# EAGLE board CLU (EAGLE 9.6.1)
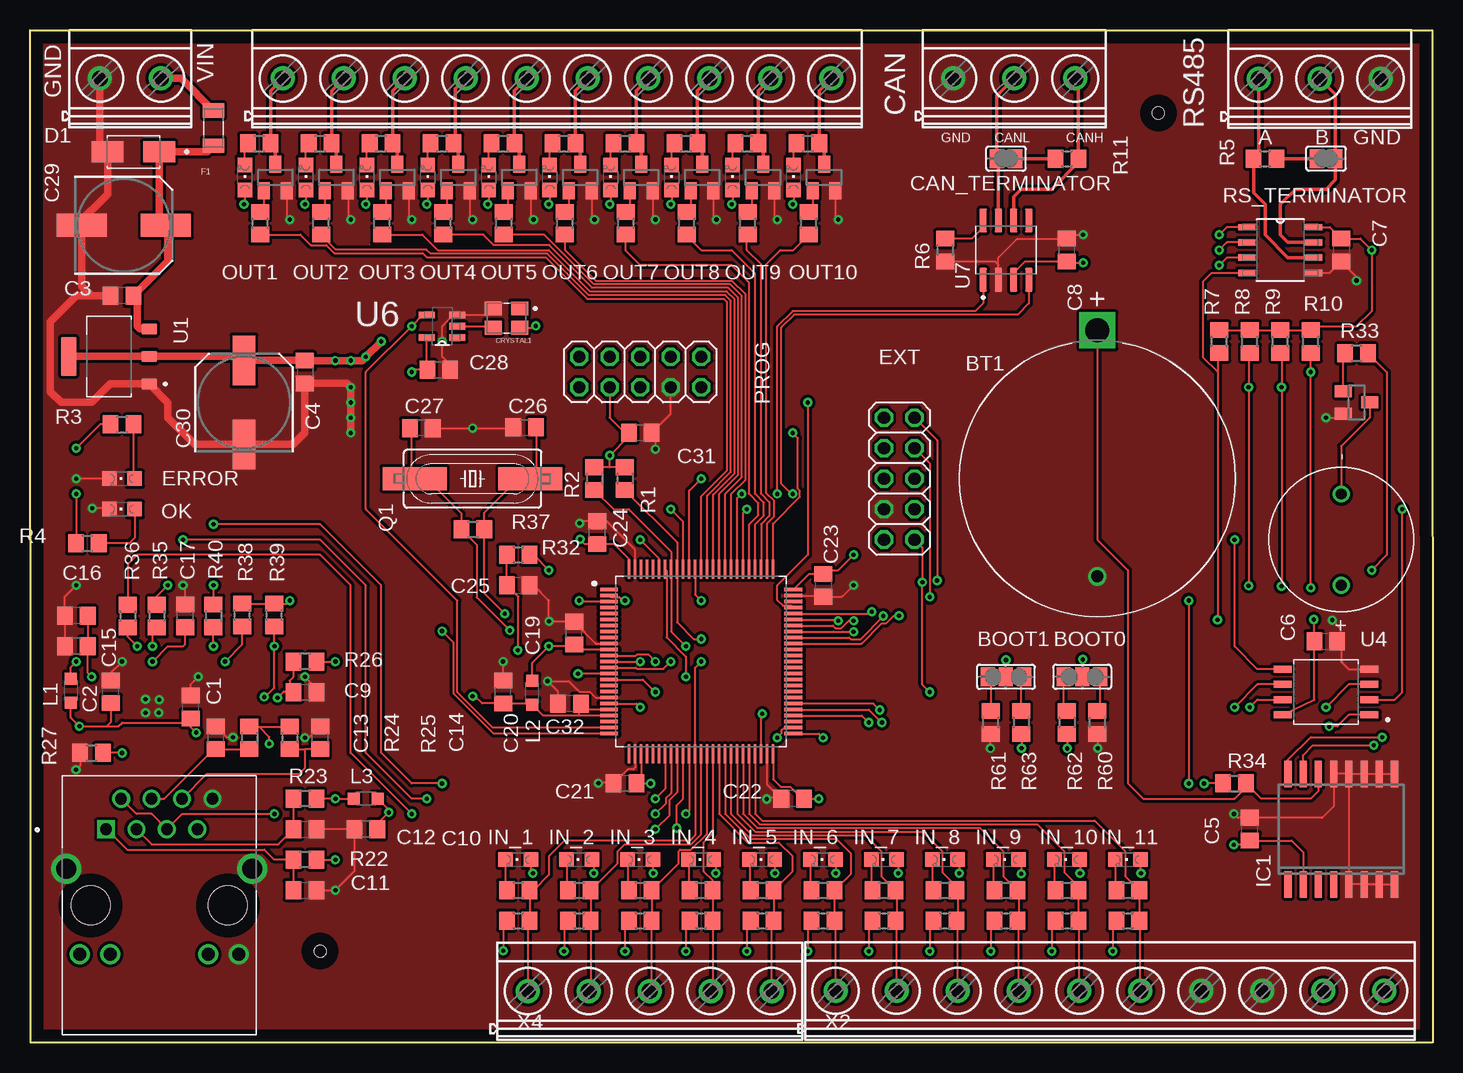
[diagram p2: board, top side]
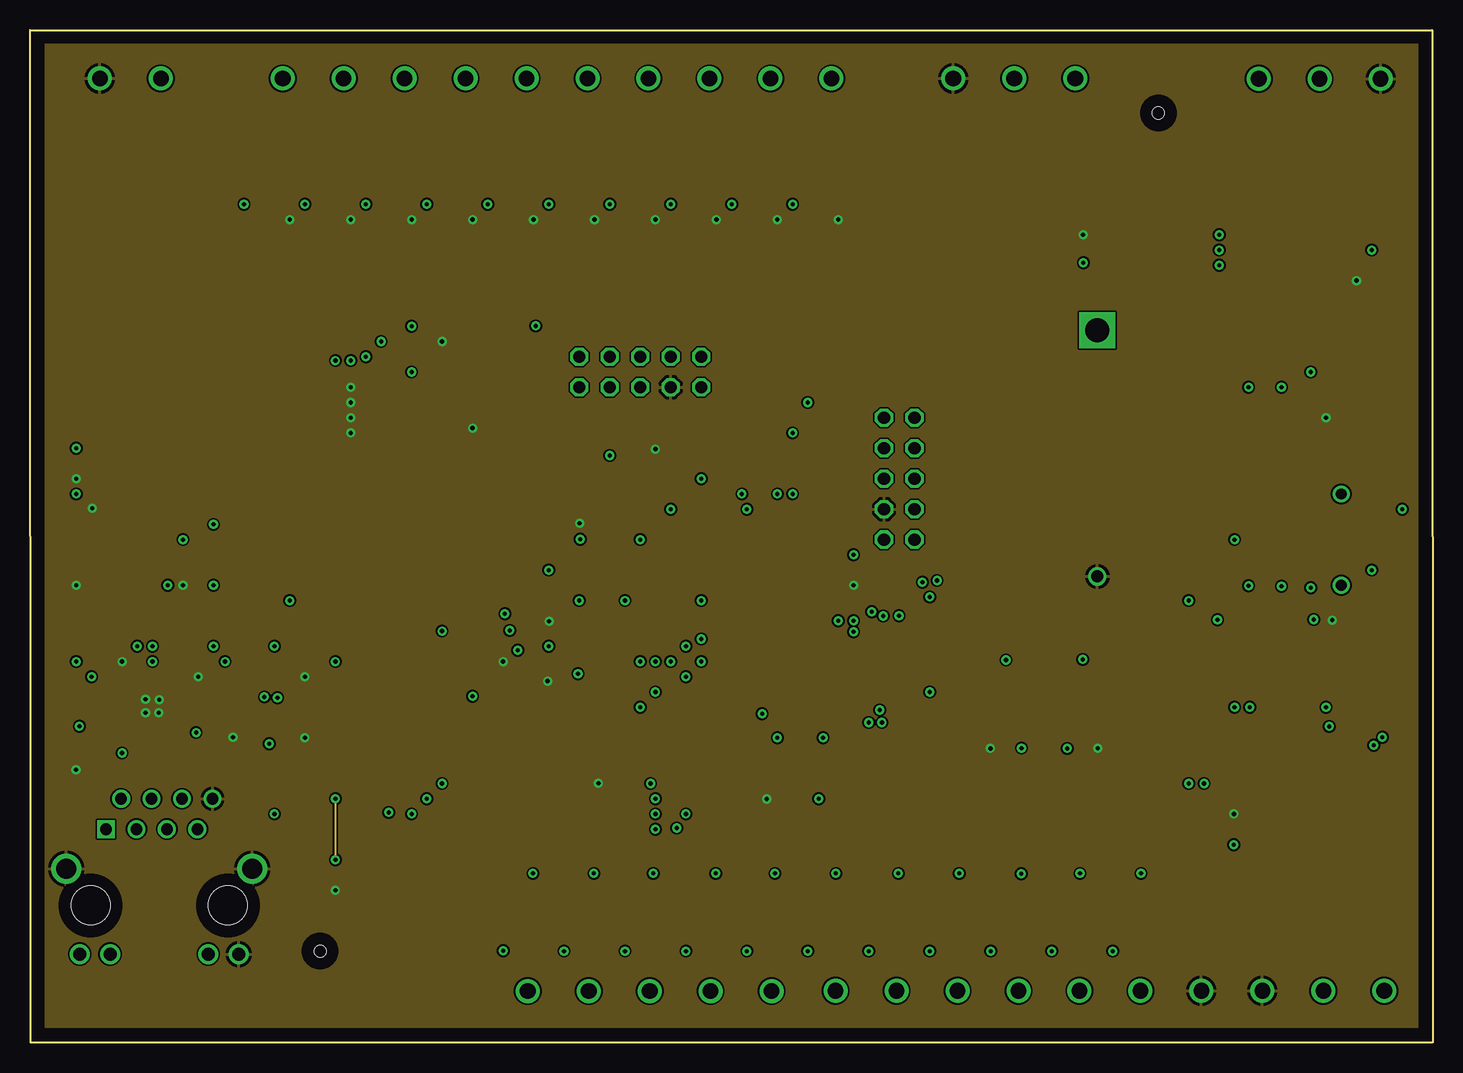
[diagram p3: board, inner layer GND]
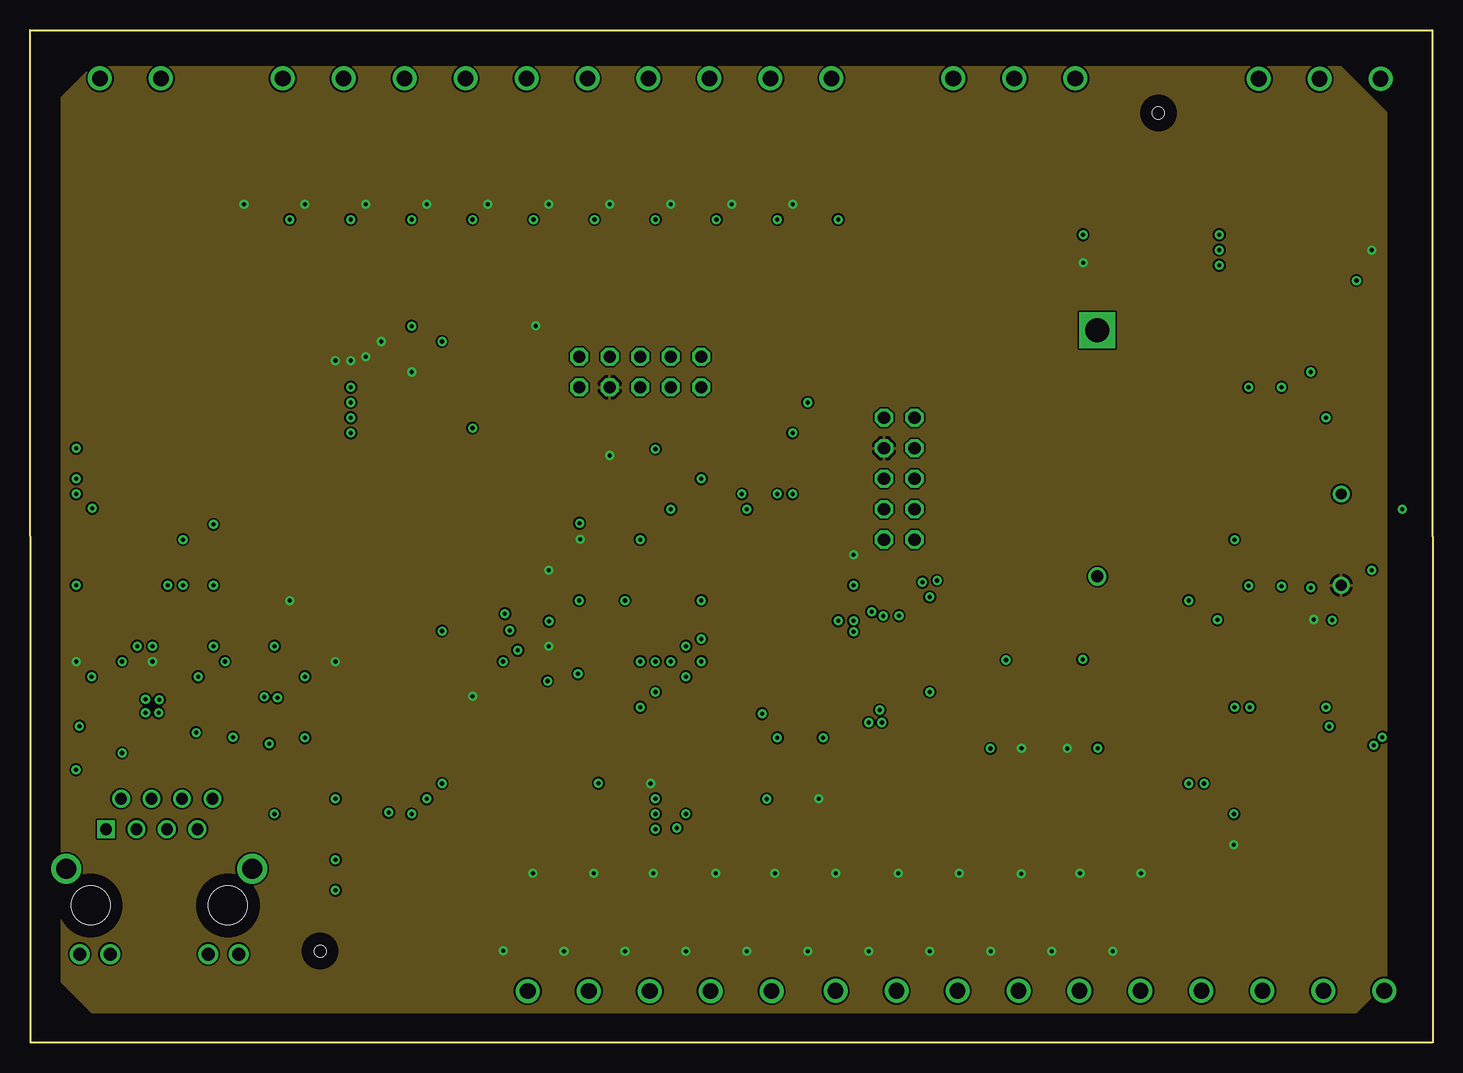
[diagram p4: board, inner layer VCC]
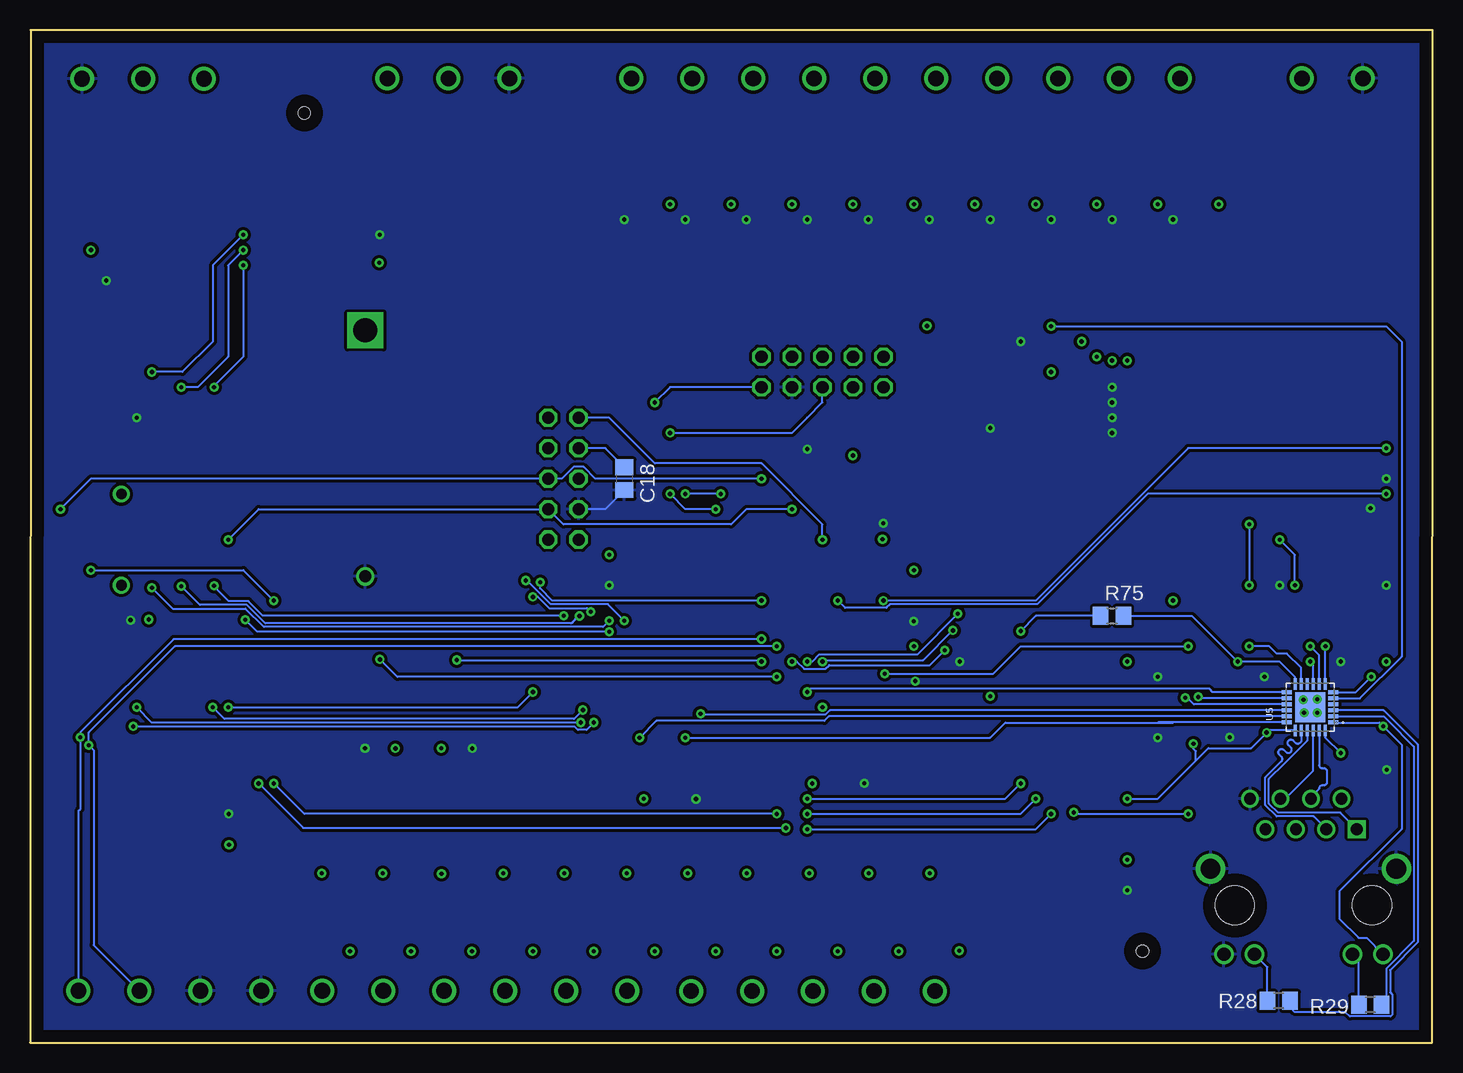
[diagram p5: board, bottom side, seen from below]

Size 116.89 x 84.38 mm. Coordinates in mm from the lower left corner, seen from the top.
Outline: 0.05,0 0,84.38 116.84,84.38 116.89,0 0.05,0
Copper layers (1+2*15+16): Top 0.035mm / dielectric 1.5mm / GND 0.035mm / dielectric 0.15mm / VCC 0.035mm / dielectric 0.2mm / Bottom 0.035mm
Design rules "default *": minimum track width 6mil, minimum drill 0.35mm, track to track 6mil, track to pad 6mil, pad to pad 6mil, via to via 6mil, smd to smd 6mil, copper to edge 40mil, drill to drill 6mil, minimum pad ring 10mil, minimum via ring 8mil, stop-mask expansion 4mil, vias tented up to drill 0mil, thermal gap 10mil
Net classes: 0 default: width 0.152 mm, drill 0.35 mm, clearance 0.152 mm; 1 SIGNALS: width 0.508 mm, drill 0.35 mm, clearance 0.152 mm; 2 GND: width 0.889 mm, clearance 0.152 mm; 3 DIFFERENTIAL: clearance 0.762 mm
Holes 1 mm at 94.03,77.47 24.18,7.62

## Footprints (pad centres in the part's own frame; a part is rotated, then mirrored left to right if it is on the bottom)
SJ_2 = smd 1.168 x 1.6: 1 -1.524,0; 2 0,0; 3 1.524,0
BAT_VL-2320/HFN = drill 1: N -8.15,0 | drill 2 square: P 12.35,0
C0805 = smd 1.3 x 1.5: 1 -0.95,0; 2 0.95,0
SANYO-OSCON_SMD_E7 = smd 4.15 x 1.9: + 3.5,0; - -3.5,0
SJ = smd 1.168 x 1.6: 1 -0.762,0; 2 0.762,0
LFSPXO025560-SMD-4 = smd 1.4 x 1.15: 1 -1.1,-0.8; 2 1.1,-0.8; 3 1.1,0.8; 4 -1.1,0.8
DIO_ES1J = smd 2.65 x 1.75: A 2.15,0; K -2.15,0
CHIPLED_0805 = smd 1.2 x 1.2: A 0,-1.05; C 0,1.05
2X05 = drill 1.016 octagon: 1 -5.08,-1.27; 2 -5.08,1.27; 3 -2.54,-1.27; 4 -2.54,1.27; 5 0,-1.27; 6 0,1.27; 7 2.54,-1.27; 8 2.54,1.27; 9 5.08,-1.27; 10 5.08,1.27
FUSC1206X75N = smd 1.19 x 1.77: 1 -1.465,0; 2 1.465,0
SO16W = smd 0.6 x 2.2: 1 -4.445,-4.6; 2 -3.175,-4.6; 3 -1.905,-4.6; 4 -0.635,-4.6; 5 0.635,-4.6; 6 1.905,-4.6; 7 3.175,-4.6; 8 4.445,-4.6; 9 4.445,4.6; 10 3.175,4.6; 11 1.905,4.6; 12 0.635,4.6; 13 -0.635,4.6; 14 -1.905,4.6; 15 -3.175,4.6; 16 -4.445,4.6
BEL_SI-60062-F = drill 0.97 square: 1 -4.445,6.35 | drill 0.97: 2 -3.175,8.89; 3 -1.905,6.35; 4 -0.635,8.89; 5 0.635,6.35; 6 1.905,8.89; 7 3.175,6.35; 8 4.445,8.89 | drill 1.1: 9 -6.625,-4.06; 10 -4.085,-4.06; 11 4.085,-4.06; 12 6.625,-4.06 | drill 1.65: S1 -7.745,3.05; S2 7.745,3.05 | hole 3.25: 5.715,0; -5.715,0
L2012C = smd 1 x 1: 1 -1,0; 2 1,0
CUI_CEM-1205C = drill 0.9: N 3.8,0; P -3.8,0
HC49UP = smd 5.334 x 1.93: 1 -4.826,0; 2 4.826,0
R0805 = smd 1.3 x 1.5: 1 -0.95,0; 2 0.95,0
SOT23 = smd 1 x 1.4: 1 -0.95,-1.1; 2 0.95,-1.1; 3 0,1.1
SOT229P700X180-4N = smd 1.31 x 0.93: 1 -3.345,2.29; 2 -3.345,0; 3 -3.345,-2.29 | smd 1.31 x 3.24: 4 3.345,0
SOIC127P600X175-8N = smd 1.422 x 0.533: 1 -2.794,1.905; 2 -2.794,0.635; 3 -2.794,-0.635; 4 -2.794,-1.905; 5 2.794,-1.905; 6 2.794,-0.635; 7 2.794,0.635; 8 2.794,1.905
QFP50P1600X1600X160-100N = smd 1.56 x 0.28: 1 -7.68,6; 2 -7.68,5.5; 3 -7.68,5; 4 -7.68,4.5; 5 -7.68,4; 6 -7.68,3.5; 7 -7.68,3; 8 -7.68,2.5; 9 -7.68,2; 10 -7.68,1.5; 11 -7.68,1; 12 -7.68,0.5; 13 -7.68,0; 14 -7.68,-0.5; 15 -7.68,-1; 16 -7.68,-1.5; 17 -7.68,-2; 18 -7.68,-2.5; 19 -7.68,-3; 20 -7.68,-3.5; 21 -7.68,-4; 22 -7.68,-4.5; 23 -7.68,-5; 24 -7.68,-5.5; 25 -7.68,-6; 51 7.68,-6; 52 7.68,-5.5; 53 7.68,-5; 54 7.68,-4.5; 55 7.68,-4; 56 7.68,-3.5; 57 7.68,-3; 58 7.68,-2.5; 59 7.68,-2; 60 7.68,-1.5; 61 7.68,-1; 62 7.68,-0.5; 63 7.68,0; 64 7.68,0.5; 65 7.68,1; 66 7.68,1.5; 67 7.68,2; 68 7.68,2.5; 69 7.68,3; 70 7.68,3.5; 71 7.68,4; 72 7.68,4.5; 73 7.68,5; 74 7.68,5.5; 75 7.68,6 | smd 0.28 x 1.56: 26 -6,-7.68; 27 -5.5,-7.68; 28 -5,-7.68; 29 -4.5,-7.68; 30 -4,-7.68; 31 -3.5,-7.68; 32 -3,-7.68; 33 -2.5,-7.68; 34 -2,-7.68; 35 -1.5,-7.68; 36 -1,-7.68; 37 -0.5,-7.68; 38 0,-7.68; 39 0.5,-7.68; 40 1,-7.68; 41 1.5,-7.68; 42 2,-7.68; 43 2.5,-7.68; 44 3,-7.68; 45 3.5,-7.68; 46 4,-7.68; 47 4.5,-7.68; 48 5,-7.68; 49 5.5,-7.68; 50 6,-7.68; 76 6,7.68; 77 5.5,7.68; 78 5,7.68; 79 4.5,7.68; 80 4,7.68; 81 3.5,7.68; 82 3,7.68; 83 2.5,7.68; 84 2,7.68; 85 1.5,7.68; 86 1,7.68; 87 0.5,7.68; 88 0,7.68; 89 -0.5,7.68; 90 -1,7.68; 91 -1.5,7.68; 92 -2,7.68; 93 -2.5,7.68; 94 -3,7.68; 95 -3.5,7.68; 96 -4,7.68; 97 -4.5,7.68; 98 -5,7.68; 99 -5.5,7.68; 100 -6,7.68
SOIC127P790X216-8N = smd 1.61 x 0.58: 1 -3.605,1.905; 2 -3.605,0.635; 3 -3.605,-0.635; 4 -3.605,-1.905; 5 3.605,-1.905; 6 3.605,-0.635; 7 3.605,0.635; 8 3.605,1.905
QFN50P400X400X100-25N = smd 0.86 x 0.26: 1 -1.935,1.25; 2 -1.935,0.75; 3 -1.935,0.25; 4 -1.935,-0.25; 5 -1.935,-0.75; 6 -1.935,-1.25; 13 1.935,-1.25; 14 1.935,-0.75; 15 1.935,-0.25; 16 1.935,0.25; 17 1.935,0.75; 18 1.935,1.25 | smd 0.26 x 0.86: 7 -1.25,-1.935; 8 -0.75,-1.935; 9 -0.25,-1.935; 10 0.25,-1.935; 11 0.75,-1.935; 12 1.25,-1.935; 19 1.25,1.935; 20 0.75,1.935; 21 0.25,1.935; 22 -0.25,1.935; 23 -0.75,1.935; 24 -1.25,1.935 | smd 2.5 x 2.5: 25 0,0
SOT95P280X145-5N = smd 1.321 x 0.559: 1 -1.27,0.94; 2 -1.27,0; 3 -1.27,-0.94; 4 1.27,-0.94; 5 1.27,0.94
SOIC127P599X175-8N = smd 1.97 x 0.6: 1 -2.47,1.905; 2 -2.47,0.635; 3 -2.47,-0.635; 4 -2.47,-1.905; 5 2.47,-1.905; 6 2.47,-0.635; 7 2.47,0.635; 8 2.47,1.905
MKDSN1,5/10-5,08 = drill 1.3 pad 2: 1 -22.881,0.025; 2 -17.801,0.025; 3 -12.721,0.025; 4 -7.641,0.025; 5 -2.561,0.025; 6 2.519,0.025; 7 7.599,0.025; 8 12.679,0.025; 9 17.759,0.025; 10 22.839,0.025
MKDSN1,5/2-5,08 = drill 1.3 pad 2: 1 -2.561,0.025; 2 2.519,0.025
MKDSN1,5/5-5,08 = drill 1.3 pad 2: 1 -10.181,0.025; 2 -5.101,0.025; 3 -0.021,0.025; 4 5.059,0.025; 5 10.139,0.025
MKDSN1,5/3-5,08 = drill 1.3 pad 2: 1 -7.641,0.025; 2 -2.561,0.025; 3 2.519,0.025

## Placement (x,y rotation side)
BOOT0  [SJ_2]  87.68,30.48 180 top
BOOT1  [SJ_2]  81.33,30.48 0 top
BT1  VL-2320/HFN  [BAT_VL-2320/HFN]  88.95,46.99 90 top
C1  100nF  [C0805]  13.39,27.97 90 top
C2  100nF  [C0805]  6.73,29.24 90 top
C3  100nF  [C0805]  7.67,62.23 180 top
C4  100nF  [C0805]  22.91,55.88 270 top
C5  100nF  [C0805]  101.65,17.78 90 top
C6  100nF  [C0805]  107.98,33.45 0 top
C7  100nF  [C0805]  109.27,66.04 270 top
C8  100nF  [C0805]  86.41,66.04 90 top
C9  100nF  [C0805]  22.91,29.21 0 top
C10  0.022uF  [C0805]  27.99,17.78 180 top
C11  100nF  [C0805]  22.91,12.7 0 top
C12  100nF  [C0805]  22.91,17.78 0 top
C13  100nF  [C0805]  15.49,25.4 90 top
C14  100nF  [C0805]  24.18,25.4 90 top
C15  470pF  [C0805]  3.86,33.02 180 top
C16  1uF  [C0805]  3.86,35.56 180 top
C17  100nF  [C0805]  12.93,35.56 90 top
C18  100nF  [C0805]  67.36,46.99 270 bottom
C19  100nF  [C0805]  45.34,34.11 90 top
C20  100nF  [C0805]  39.42,29.21 90 top
C21  100nF  [C0805]  49.58,21.59 180 top
C22  100nF  [C0805]  63.55,20.32 180 top
C23  100nF  [C0805]  66.09,38.1 270 top
C24  100nF  [C0805]  47.27,42.49 90 top
C25  100nF  [C0805]  40.69,38.1 0 top
C26  22pF  [C0805]  41.22,51.26 0 top
C27  22pF  [C0805]  32.61,51.21 180 top
C28  100nF  [C0805]  34.06,56.06 0 top
C29  100uF  [SANYO-OSCON_SMD_E7]  7.82,68.1 0 top
C30  100uF  [SANYO-OSCON_SMD_E7]  17.83,53.34 90 top
C31  100nF  [C0805]  50.85,50.8 180 top
C32  100nF  [C0805]  44.96,28.24 180 top
CAN_TERMINATOR  [SJ]  81.33,73.66 0 top
CRYSTAL1  LFSPXO025560  [LFSPXO025560-SMD-4]  39.7,60.38 180 top
D1  BYG10D  [DIO_ES1J]  8.61,74.22 180 top
ERROR  [CHIPLED_0805]  7.67,46.99 90 top
EXT  [2X05]  72.44,46.99 270 top
F1  ERBRG1R25V  [FUSC1206X75N]  15.29,76.2 270 top
IC1  DS3231/SO  [SO16W]  109.27,17.78 0 top
IN_1  [CHIPLED_0805]  40.69,15.24 90 top
IN_2  [CHIPLED_0805]  45.77,15.24 90 top
IN_3  [CHIPLED_0805]  50.85,15.24 90 top
IN_4  [CHIPLED_0805]  55.93,15.24 90 top
IN_5  [CHIPLED_0805]  61.01,15.24 90 top
IN_6  [CHIPLED_0805]  66.09,15.24 90 top
IN_7  [CHIPLED_0805]  71.17,15.24 90 top
IN_8  [CHIPLED_0805]  76.25,15.24 90 top
IN_9  [CHIPLED_0805]  81.33,15.24 90 top
IN_10  [CHIPLED_0805]  86.41,15.24 90 top
IN_11  [CHIPLED_0805]  91.49,15.24 90 top
J2  SI-60062-F  [BEL_SI-60062-F]  10.77,11.43 0 top
L1  [L2012C]  3.4,29.34 270 top
L2  [L2012C]  41.86,29.16 90 top
L3  [L2012C]  27.99,20.32 180 top
LS1  CEM-1205C  [CUI_CEM-1205C]  109.27,41.91 90 top
OK  [CHIPLED_0805]  7.67,44.45 90 top
OUT1  [CHIPLED_0805]  17.91,72.09 0 top
OUT2  [CHIPLED_0805]  22.99,72.09 0 top
OUT3  [CHIPLED_0805]  28.07,72.09 0 top
OUT4  [CHIPLED_0805]  33.15,72.09 0 top
OUT5  [CHIPLED_0805]  38.23,72.09 0 top
OUT6  [CHIPLED_0805]  43.31,72.09 0 top
OUT7  [CHIPLED_0805]  48.39,72.09 0 top
OUT8  [CHIPLED_0805]  53.47,72.09 0 top
OUT9  [CHIPLED_0805]  58.55,72.09 0 top
OUT10  [CHIPLED_0805]  63.63,72.09 0 top
PROG  [2X05]  50.85,55.88 180 top
Q1  [HC49UP]  36.88,46.99 0 top
R1  10k  [R0805]  49.58,46.99 270 top
R2  10k  [R0805]  47.04,46.99 270 top
R3  330R  [R0805]  7.67,51.51 0 top
R4  330R  [R0805]  4.78,41.61 0 top
R5  120R  [R0805]  102.92,73.66 0 top
R6  4k7  [R0805]  76.25,66.04 270 top
R7  10k  [R0805]  99.11,58.42 90 top
R8  10k  [R0805]  101.65,58.42 90 top
R9  10k  [R0805]  104.19,58.42 90 top
R10  10k  [R0805]  106.73,58.42 90 top
R11  120R  [R0805]  86.41,73.66 0 top
R12  10k  [R0805]  19.18,68.28 90 top
R13  10k  [R0805]  24.26,68.28 90 top
R14  10k  [R0805]  29.34,68.28 90 top
R15  10k  [R0805]  34.42,68.28 90 top
R16  10k  [R0805]  39.5,68.28 90 top
R17  10k  [R0805]  44.58,68.28 90 top
R18  10k  [R0805]  49.66,68.28 90 top
R19  10k  [R0805]  54.74,68.28 90 top
R20  10k  [R0805]  59.82,68.28 90 top
R21  10k  [R0805]  64.9,68.28 90 top
R22  49R9  [R0805]  22.91,15.24 180 top
R23  49R9  [R0805]  22.91,20.32 180 top
R24  49R9  [R0805]  18.29,25.4 270 top
R25  49R9  [R0805]  21.64,25.4 270 top
R26  4k7  [R0805]  22.91,31.75 180 top
R27  12.1k  [R0805]  5.13,24.13 0 top
R28  200R  [R0805]  12.83,3.48 180 bottom
R29  200R  [R0805]  5.21,3.15 180 bottom
R30  10k  [R0805]  45.77,10.16 0 top
R31  10k  [R0805]  50.85,10.16 0 top
R32  10k  [R0805]  40.69,40.64 0 top
R33  10k  [R0805]  110.54,57.43 180 top
R34  200R  [R0805]  100.38,21.59 0 top
R35  100R  [R0805]  10.57,35.53 270 top
R36  100R  [R0805]  8.15,35.53 270 top
R37  1M  [R0805]  36.91,42.77 0 top
R38  1k5  [R0805]  17.68,35.64 90 top
R39  1k5  [R0805]  20.35,35.64 90 top
R40  100R  [R0805]  15.29,35.56 270 top
R41  10k  [R0805]  61.01,10.16 0 top
R42  10k  [R0805]  71.17,10.16 0 top
R43  10k  [R0805]  55.93,10.16 0 top
R44  10k  [R0805]  40.69,10.16 0 top
R45  10k  [R0805]  66.09,10.16 0 top
R46  10k  [R0805]  76.25,10.16 0 top
R47  10k  [R0805]  86.41,10.16 0 top
R48  10k  [R0805]  81.33,10.16 0 top
R49  10k  [R0805]  91.49,10.16 0 top
R50  200R  [R0805]  19.1,74.93 0 top
R51  200R  [R0805]  24.18,74.93 0 top
R52  200R  [R0805]  29.26,74.93 0 top
R53  200R  [R0805]  34.34,74.93 0 top
R54  200R  [R0805]  39.42,74.93 0 top
R55  200R  [R0805]  44.5,74.93 0 top
R56  200R  [R0805]  49.58,74.93 0 top
R57  200R  [R0805]  54.66,74.93 0 top
R58  200R  [R0805]  59.74,74.93 0 top
R59  200R  [R0805]  64.82,74.93 0 top
R60  10k  [R0805]  88.95,26.67 90 top
R61  10k  [R0805]  80.06,26.67 90 top
R62  10k  [R0805]  86.41,26.67 270 top
R63  10k  [R0805]  82.6,26.67 270 top
R64  200R  [R0805]  40.69,12.7 0 top
R65  200R  [R0805]  45.77,12.7 0 top
R66  200R  [R0805]  50.85,12.7 0 top
R67  200R  [R0805]  55.93,12.7 0 top
R68  200R  [R0805]  61.01,12.7 0 top
R69  200R  [R0805]  66.09,12.7 0 top
R70  200R  [R0805]  71.17,12.7 0 top
R71  200R  [R0805]  76.25,12.7 0 top
R72  200R  [R0805]  81.33,12.7 0 top
R73  200R  [R0805]  86.41,12.7 0 top
R74  200R  [R0805]  91.49,12.7 0 top
R75  100R  [R0805]  26.72,35.56 0 bottom
RS_TERMINATOR  [SJ]  108,73.66 0 top
T1  BC848  [SOT23]  20.45,72.09 0 top
T2  BC848  [SOT23]  25.53,72.09 0 top
T3  BC848  [SOT23]  30.61,72.09 0 top
T4  BC848  [SOT23]  35.69,72.09 0 top
T5  BC848  [SOT23]  40.77,72.09 0 top
T6  BC848  [SOT23]  45.85,72.09 0 top
T7  BC848  [SOT23]  50.93,72.09 0 top
T8  BC848  [SOT23]  56.01,72.09 0 top
T9  BC848  [SOT23]  61.09,72.09 0 top
T10  BC848  [SOT23]  66.17,72.09 0 top
T11  BC848  [SOT23]  110.54,53.34 270 top
U1  AMS1117  [SOT229P700X180-4N]  6.58,57.18 180 top
U2  ST3485ECDR  [SOIC127P600X175-8N]  104.19,66.04 0 top
U3  STM32F107VCT6  [QFP50P1600X1600X160-100N]  55.93,31.75 0 top
U4  W25Q64BVSSIG  [SOIC127P790X216-8N]  108,29.21 180 top
U5  LAN8720A-CP  [QFN50P400X400X100-25N]  10.21,27.94 180 bottom
U6  74LVC1G17W5-7  [SOT95P280X145-5N]  34.34,59.69 180 top
U7  SN65HVD230  [SOIC127P599X175-8N]  81.33,66.04 90 top
X1  MKDSN1,5/10-5,08  [MKDSN1,5/10-5,08]  43.94,80.31 0 top
X2  MKDSN1,5/10-5,08  [MKDSN1,5/10-5,08]  90.02,4.29 0 top
X3  MKDSN1,5/2-5,08  [MKDSN1,5/2-5,08]  8.38,80.31 0 top
X4  MKDSN1,5/5-5,08  [MKDSN1,5/5-5,08]  51.66,4.27 0 top
X5  MKDSN1,5/3-5,08  [MKDSN1,5/3-5,08]  84.58,80.31 0 top
X6  MKDSN1,5/3-5,08  [MKDSN1,5/3-5,08]  110.03,80.29 0 top

## Tracks (layer width: path | path; a pad name or v marks a point on that pad's centre or on a via)
12V
  Top 0.152: C29.+ 10.83,68.1 10.76,68.03
  Top 0.61: F1.2 14.77,74.22 D1.K 10.76,68.03 11.48,67.31 11.48,65.09 C3.1 8.94,61.91 8.94,59.69 9.17,59.47 U1.3
BOOT0  (via drill 0.35)
  Top 0.152: 87.36,30.8 BOOT0.2 87.73,30.53 v87.73,31.93 | U3.94 53.06,39.3 53.06,33.76 54.66,32.16 v54.66,30.48
  Bottom 0.152: v54.66,30.48 86.28,30.48 v87.73,31.93
BUZZER  (via drill 0.35)
  Top 0.152: U3.36 54.93,19.32 v54.66,19.05 | R33.1 113.04,55.88 113.08,55.88 113.08,40.64 v111.81,39.37 | v96.57,36.83 v96.57,21.59
  Bottom 0.152: v54.66,19.05 94.03,19.05 v96.57,21.59 | v111.81,39.37 99.11,39.37 v96.57,36.83
CAN_RX  (via drill 0.35)
  Top 0.152: 59.47,44.18 v59.74,44.45 59.43,44.14 U3.81 | v63.55,45.72 63.45,45.72 62.61,46.56 62.61,59.59 63.68,60.66 82.3,60.66 83.24,61.59 U7.4
  Bottom 0.152: v59.74,44.45 62.28,44.45 v63.55,45.72
CAN_TX  (via drill 0.35)
  Top 0.152: U3.82 58.93,45.37 59.28,45.72 v59.32,45.72 | v62.28,45.72 62.28,59.69 63.55,60.96 78.79,60.96 79.43,61.59 U7.1
  Bottom 0.152: v59.32,45.72 v62.28,45.72
EHT_MDIO_LAN  (via drill 0.35)
  Top 0.152: 17.83,34.53 R38.1 17.68,33.17 v16.26,31.75
  Bottom 0.152: U5.12 11.46,30.46 12.75,31.75 v16.26,31.75 20.07,35.56 R75.2
ETH_CRS_DV  (via drill 0.35)
  Top 0.152: U3.32 52.93,21.13 v52.12,20.32 | v34.34,21.59 31.8,21.59 29.26,24.13 29.26,38.1 24.18,43.18 v15.29,43.18 | v15.29,38.1 R40.1
  Bottom 0.152: v52.12,20.32 35.61,20.32 v34.34,21.59 | v15.29,43.18 v15.29,38.1
ETH_INT  (via drill 0.35)
  Top 0.152: v19.53,28.8 19.61,28.8 20.37,29.57 v20.37,33.02 20.37,34.66 R39.1 | U3.15 45.68,30.75 v45.67,30.73
  Bottom 0.152: U5.14 19.53,28.69 v19.53,28.8 | v20.37,33.02 34.34,33.02 36.63,30.73 v45.67,30.73
ETH_LED1
  Bottom 0.152: R28.1 11.88,2.94 11.48,2.54 7.27,2.54 6.9,2.17 3.51,2.17 3.38,2.31 3.38,3.99 3.56,4.17 3.56,6.04 1.25,8.34 1.25,24.86 3.95,27.55 4.09,27.69 U5.3
ETH_LED2
  Bottom 0.152: R29.1 4.26,2.94 3.86,2.54 3.86,6.16 1.56,8.47 1.56,24.66 3.71,26.82 3.95,27.05 4.09,27.19 U5.2
ETH_MDC  (via drill 0.35)
  Top 0.152: U3.16 51.08,30.25 v52.12,29.21
  Bottom 0.152: U5.13 12.17,29.21 18.34,29.21 18.59,29.46 51.87,29.46 v52.12,29.21
ETH_MDIO  (via drill 0.35)
  Top 0.152: U3.25 38.64,25.75 35.31,29.08 35.31,33.33 v34.34,34.29
  Bottom 0.152: R75.1 33.07,35.56 v34.34,34.29
ETH_RBIAS  (via drill 0.35)
  Top 0.152: v7.67,24.13 R27.2
  Bottom 0.152: U5.24 8.96,25.42 v7.67,24.13
ETH_RST  (via drill 0.35)
  Top 0.152: R26.2 21.96,30.48 21.64,30.16 21.64,29.23 21.13,29.23 21.11,29.21 | 21.64,29.21 C9.1 21.11,29.21 | v20.62,28.73 20.74,28.84 21.11,29.21
  Bottom 0.152: U5.15 19.91,28.19 20.45,28.73 v20.62,28.73
ETH_RX_N
  Top 0.152: R25.2 22.91,24.45 | C14.1 22.91,24.45 | J2.6 14.74,22.39 22.44,22.39 22.91,22.86 22.91,24.45
  Bottom 0.152: U5.22 9.96,22.63 12.27,20.32 J2.6
ETH_RX_P
  Top 0.152: J2.4 11.19,20.32 15.32,24.45 C13.1 R24.2
  Bottom 0.152: U5.23 9.46,23.13 arc-90 9.19,22.86 9.08,22.86 arc90 8.81,22.6 8.81,21.7 arc90 9.08,21.43 9.19,21.43 arc-90 9.46,21.16 10.3,20.32 J2.4
ETH_RXD0  (via drill 0.35)
  Top 0.152: U3.33 53.43,20.79 52.99,20.35 52.99,19.92 v52.12,19.05 | v33.07,20.32 31.8,20.32 27.99,24.13 27.99,38.1 24.18,41.91 v12.75,41.91 | R35.1 10.57,37.19 v11.48,38.1
  Bottom 0.152: v52.12,19.05 34.34,19.05 v33.07,20.32 | v11.48,38.1 11.48,40.64 v12.75,41.91
ETH_RXD1  (via drill 0.35)
  Top 0.152: U3.34 53.93,20.86 53.29,20.22 53.29,18.95 v52.12,17.78 | v31.8,19.05 26.72,24.13 26.72,38.1 24.18,40.64 8.94,40.64 8.15,39.85 R36.1
  Bottom 0.152: v31.8,19.05 33.07,17.78 v52.12,17.78
ETH_TX_EN  (via drill 0.35)
  Top 0.152: U3.48 60.93,27.33 v61.01,27.41
  Bottom 0.152: U5.16 50.24,27.69 50.6,27.33 60.94,27.33 v61.01,27.41
ETH_TX_N
  Top 0.152: R23.2 C12.1 20.69,16.51 10.13,16.51 J2.3
  Bottom 0.152: U5.20 10.96,25.08 11.06,24.98 arc90 11.44,24.98 11.62,25.16 arc-90 12,25.16 12.01,25.15 arc-90 12.01,24.77 11.83,24.59 arc90 11.83,24.22 11.84,24.2 arc90 12.22,24.2 12.4,24.39 arc-90 12.77,24.39 12.79,24.37 arc-90 12.79,24 12.6,23.82 arc90 12.6,23.44 13.95,22.1 13.95,19.79 13,18.85 9.93,18.85 J2.3
ETH_TX_P
  Top 0.152: C11.1 R22.2 20.37,15.24 19.53,16.08 8.1,16.08 6.4,17.78 J2.1
  Bottom 0.152: U5.21 10.46,25.15 10.85,24.77 12.39,23.22 13.64,21.97 13.64,19.92 12.87,19.15 7.7,19.15 J2.1
ETH_TXD0  (via drill 0.35)
  Top 0.152: U3.51 65.74,25.75 v66.09,25.4
  Bottom 0.152: U5.17 50.31,27.19 50.7,26.8 64.69,26.8 v66.09,25.4
ETH_TXD1  (via drill 0.35)
  Top 0.152: v62.28,25.4 62.6,25.72 62.6,25.96 62.89,26.25 U3.52
  Bottom 0.152: v62.28,25.4 36.88,25.4 35.61,26.67 22.91,26.67 | 22.91,26.67 21.64,26.67 | U5.18 22.89,26.69 22.91,26.67
ETH_VDDA  (via drill 0.35)
  Top 0.152: 6.83,28.18 C2.1 6.73,26.69 6.4,26.36 | 6.4,26.36 v4.12,26.36 3.4,27.08 L1.2 | R24.1 18.34,26.3 19.1,26.3 | 6.4,26.36 7.36,26.36 7.67,26.67 13.04,26.67 C1.1 13.39,26.29 v13.84,25.83 | 21.62,26.38 R25.1 21.59,26.3 19.1,26.3 | L3.2 v25.45,20.32 R23.1 | R22.1 v25.45,15.24 | v19.94,24.89 19.94,25.46 19.1,26.3
  GND 0.152: v25.45,20.32 v25.45,15.24
  Bottom 0.152: U5.1 8.26,26.67 4.42,26.67 v4.11,26.36 v4.12,26.36 2.59,24.84 2.59,17.78 7.77,12.6 7.77,10.3 6.18,8.71 5.49,8.71 J2.9 | v25.45,20.32 22.91,20.32 19.74,23.5 | U5.19 13.67,26 v13.84,25.83 15.14,24.54 18.69,24.54 19.74,23.5 | 19.74,23.5 19.74,24.28 19.94,24.49 v19.94,24.89
ETH_VDDCR  (via drill 0.35)
  Top 0.152: v5.13,30.48 4.81,30.8 C15.1 C16.1
  Bottom 0.152: U5.6 6.42,29.19 v5.13,30.48
ETH_XTAL1  (via drill 0.35)
  Top 0.152: U6.4 32.74,60.63 v31.8,59.69 27.99,55.88 27.99,44.45 35.61,36.83 35.61,29.21 38.57,26.25 U3.24
  Bottom 0.152: v31.8,59.69 3.86,59.69 2.59,58.42 2.59,32.16 6.06,28.69 U5.5
GND  (via drill 0.35)
  Top 0.152: U3.10 47.15,33.25 C19.2 45.3,35.1 v43.26,35.1 43.26,35.09 43.23,35.06 43.23,36.83 41.96,38.1 C25.2 | U3.74 65.99,37.25 C23.2 67.68,37.15 v68.63,38.1 | U3.27 50.43,22.91 50.28,22.76 49.8,22.76 C21.2 48.58,21.64 47.4,21.64 v47.37,21.61 | U3.49 61.43,21.49 C22.2 62.52,20.4 61.49,20.4 v61.39,20.3 | IC1.12 IC1.13 108.64,19.68 107.68,18.73 C5.2 100.65,18.73 v100.33,19.05 | T1.2 21.4,68.82 v21.64,68.58 | T2.2 26.53,70.93 26.53,68.77 v26.72,68.58 | OK.C 6.54,44.53 v5.18,44.53 | ERROR.C v3.86,46.99 | T5.2 41.72,68.82 v41.96,68.58 | T6.2 46.8,68.82 v47.04,68.58 | T7.2 51.88,68.82 v52.12,68.58 | T8.2 56.96,68.82 v57.2,68.58 | T9.2 62.04,68.82 v62.28,68.58 | T10.2 67.12,68.82 v67.36,68.58 | C11.2 v25.45,12.7 27.04,14.29 C10.2 C12.2 | 38.6,61.41 CRYSTAL1.2 38.05,60.63 U6.3 35.28,60.63 34.34,59.69 v34.34,58.42 34.34,57.15 35.01,56.48 C28.2 | C27.1 v36.88,51.21 40.22,51.21 C26.1 | C24.2 46.88,43.44 | C20.2 v39.42,31.75 | C32.2 44.01,29.25 v43.13,30.12 44.88,30.12 45.78,29.22 46.65,29.22 47.13,28.75 U3.19 48.31,28.75 | 15.49,26.67 C13.2 16.39,25.45 v16.92,25.45 | v80.04,24.51 80.04,25.7 R61.1 | 80.7,64.77 80.7,65.41 82.28,66.99 C8.2 86.73,67.31 v87.76,67.31 | U2.5 108.32,64.14 C7.2 110.54,63.82 v110.54,63.5 | R27.1 4.18,23.08 v3.84,22.73 | 2.49,32.6 C15.2 C16.2 2.91,37.15 v3.86,38.1 | C17.2 12.93,37.92 v12.75,38.1 | U4.4 109.91,31.11 109.27,31.75 109.27,33.11 C6.2 109.19,33.72 109.19,34.52 v108.51,35.2 | T11.2 109.12,52.07 v108,52.07 | R6.2 80.38,65.09 80.7,64.77 | C9.2 23.86,29.53 v22.91,30.48 | C14.2 23.23,25.4 v22.91,25.4 | C2.2 6.73,30.81 v7.67,31.75 | C1.2 13.39,29.84 v14.02,30.48 | v45.8,43.28 45.96,43.44 C24.2
  Top 0.152: U3.99 50.43,41.06 48.05,43.44 C24.2 | T3.2 31.56,68.82 v31.8,68.58 | T4.2 36.64,68.82 v36.88,68.58 | R60.1 88.98,25.7 v88.98,24.54 | PROG.4 53.39,52.39 C31.1 52.12,50.48 v52.12,49.45 | IC1.10 IC1.9 | IC1.7 IC1.5 IC1.12 | IC1.7 IC1.8 | IC1.6 IC1.7 | IC1.12 IC1.10 | IC1.11 IC1.10 | U7.2 80.7,64.77
  Top 0.305: D1.A 6.4,74.22 | C29.- 3.86,68.1
  Top 0.61: X3.1 5.82,74.8 6.4,74.22 | D1.A 6.46,70.7 3.86,68.1 | C29.- 4.32,63.04 5.13,62.23 | 5.13,62.23 C3.2 | 5.13,62.23 3.86,62.23 1.69,60.06 1.69,57.17 1.69,54.24 2.59,53.34 5.13,53.34 6.68,54.88 U1.1 11.48,53.33 11.48,52.07 13.71,49.84 C30.- 21.95,49.84 22.91,50.8 C4.2 | C4.2 25.13,54.93 | v26.72,50.8 v26.72,52.07 v26.72,53.34 v26.72,54.61 26.4,54.93 C4.2
  Bottom 0.152: C18.2 68.95,44.45 EXT.7 | 10.21,28.02 v10.77,28.57 | U5.25 10.21,28.02 | 10.21,28.02 v9.63,28.6 | U5.25 9.75,27.48 v9.63,27.48 | U5.25 10.26,27.94 v10.72,27.48
  pour Bottom (isolate 0.254): 0.05,83.82 116.89,83.82 116.89,0 0.05,0
  pour Top (isolate 0.254, no thermals): 0.05,83.82 116.89,83.82 116.89,0 0.05,0
  pour GND: 1.32,83.82 115.62,83.82 115.62,1.27 1.32,1.27
I2C1_SCL  (via drill 0.35)
  Top 0.152: v55.93,33.63 55.32,33.63 53.93,35.02 U3.92 53.93,41.69 R1.2 | v112.7,25.45 106.73,25.45 104.83,23.55 IC1.16
  Bottom 0.152: v55.93,33.63 68.63,33.63 104.93,33.63 112.7,25.86 v112.7,25.45 112.7,19.46 112.86,19.3 X2.10
I2C1_SDA  (via drill 0.35)
  Top 0.152: v54.66,33.02 53.43,34.25 U3.93 53.43,40.92 49.9,44.45 48.63,44.45 R2.2 | v111.99,24.77 106.91,24.77 106.1,23.95 IC1.15
  Bottom 0.152: v54.66,33.02 104.83,33.02 111.99,25.86 v111.99,24.77 111.59,24.36 111.59,8.13 X2.9
IN_1  (via drill 0.35)
  Top 0.152: v55.93,31.75 55.43,31.25 U3.37 55.43,17.28 54.97,16.82 44.5,16.82 43.23,15.54 43.23,13.97 41.96,12.7 R64.2 R44.2 41.48,10 X4.1 | BOOT1.2 v81.33,31.88
  Bottom 0.152: v81.33,31.88 56.06,31.88 v55.93,31.75
IN_2
  Top 0.152: U3.38 55.93,17.35 55.09,16.51 49.55,16.51 48.97,15.94 48.97,14.95 R65.2 R30.2 46.72,4.45 X4.2
IN_3
  Top 0.152: U3.39 56.43,17.42 55.08,16.07 54.19,16.07 54.05,15.94 54.05,14.95 R66.2 R31.2 51.8,4.76 51.64,4.6 X4.3
IN_4
  Top 0.152: U3.40 56.93,17.48 56.15,16.7 56.15,14.24 56.88,13.51 R67.2 R43.2 56.88,4.45 X4.4
IN_5
  Top 0.152: U3.41 57.43,19.05 59.82,16.66 62.42,16.66 63.55,15.53 63.55,14.29 R68.2 R41.2 61.8,10 X4.5
IN_6
  Top 0.152: U3.42 57.93,19.05 60.01,16.97 67.19,16.97 68.43,15.73 68.43,14.09 R69.2 R45.2 67.14,10.06 X2.1
IN_7
  Top 0.152: U3.43 58.41,24.05 58.41,19.05 60.18,17.27 69.61,17.27 70.95,15.94 70.95,13.87 R70.2 72.22,12.6 72.22,10.06 | X2.2 72.22,10.06 | 72.22,10.06 R42.2
IN_8
  Top 0.152: U3.44 58.96,24.05 58.96,19.05 60.43,17.58 74.39,17.58 76.03,15.94 76.03,14.19 77.2,13.02 R71.2 77.3,12.6 77.3,10.06 | X2.3 77.3,10.06 | 77.3,10.06 R46.2
IN_9
  Top 0.152: U3.45 59.43,19.05 60.6,17.88 79.16,17.88 81.11,15.94 81.11,13.87 R72.2 82.38,12.6 82.38,10.06 | X2.4 82.38,10.06 | 82.38,10.06 R48.2
IN_10
  Top 0.152: U3.46 59.93,19.05 60.79,18.19 83.94,18.19 86.19,15.94 86.19,14.19 87.36,13.02 R73.2 R47.2 87.46,10.06 X2.5
IN_11
  Top 0.152: U3.47 60.43,19.05 60.45,19.05 61.01,18.49 88.71,18.49 91.27,15.94 91.27,13.87 R74.2 R49.2 92.54,10.06 X2.6
LED_ERROR  (via drill 0.35)
  Top 0.152: U3.3 45.85,36.75 v45.77,36.83 | R3.1 5.84,51.51 v3.86,49.53
  Bottom 0.152: v45.77,36.83 33.07,36.83 20.37,49.53 v3.86,49.53
LED_OK  (via drill 0.35)
  Top 0.152: R4.1 3.86,41.64 v3.86,45.72 | U3.2 48.38,37.12 49.1,37.12 49.39,36.83 v49.58,36.83
  Bottom 0.152: v3.86,45.72 23.75,45.72 32.94,36.52 45.22,36.52 45.52,36.22 48.97,36.22 v49.58,36.83
N$1
  Top 0.305: X5.2 80.57,78.89 CAN_TERMINATOR.1 80.7,73.53 U7.7
N$2
  Top 0.305: X5.3 87.36,80.08 R11.2 87.36,73.34 85.14,71.12 82.6,71.12 81.97,70.48 U7.6
N$3
  Top 0.305: X6.1 102.39,74.08 R5.1 101.97,70.8 102.92,69.85 102.92,67.31 104.83,65.41 U2.6
N$4
  Top 0.305: X6.2 108.76,79.02 RS_TERMINATOR.2 108.76,71.88 108,71.12 105.46,71.12 104.19,69.85 104.19,67.31 104.83,66.67 U2.7
N$5
  Top 0.152: IC1.14 107.37,20.95 106.73,20.32 102.6,20.32 101.49,21.43 | 101.49,21.43 R34.2 | BT1.P 88.95,41.91 91.49,39.37 91.49,21.59 92.76,20.32 100.38,20.32 101.49,21.43
N$6
  Top 0.152: T6.1 44.9,69.55 R17.2
N$8
  Top 0.152: T7.1 49.98,69.55 R18.2
N$9
  Top 0.152: T8.1 55.06,69.55 R19.2
N$10
  Top 0.152: T9.1 60.14,69.55 R20.2
N$11
  Top 0.152: OUT1.C 17.91,74.69 R50.1
N$12
  Top 0.152: T10.1 65.22,69.55 R21.2
N$13
  Top 0.305: R5.2 RS_TERMINATOR.1
N$14
  Top 0.152: U7.8 79.43,67.94 78.47,66.99 R6.1
N$15
  Top 0.305: CAN_TERMINATOR.2 R11.1
N$16
  Top 0.152: T1.1 19.5,69.55 R12.2
N$17
  Top 0.152: T2.1 24.58,69.55 R13.2
N$18
  Top 0.152: OK.A 8.72,42.06 8.26,41.6 R4.2
N$19
  Top 0.152: R3.2 8.62,47.09 ERROR.A
N$20
  Top 0.152: T3.1 29.66,69.55 R14.2
N$21
  Top 0.152: T4.1 34.74,69.55 R15.2
N$22
  Top 0.152: T5.1 39.82,69.55 R16.2
N$23
  Top 0.152: OUT2.C 22.99,74.69 R51.1
N$24
  Top 0.152: OUT3.C 28.07,74.69 R52.1
N$25
  Top 0.152: OUT4.C 33.15,74.69 R53.1
N$26
  Top 0.152: OUT5.C 38.23,74.69 R54.1
N$27  (via drill 0.35)
  Top 0.152: J2.2 8.86,19.05 10.13,19.05 J2.5 12.67,19.05 v20.37,19.05 | 28.99,17.83 C10.1 28.94,18.21 v29.9,19.18 29.9,19.41 L3.1
  Bottom 0.152: v20.37,19.05 20.4,19.07 29.8,19.07 v29.9,19.18
N$28
  Top 0.152: OUT6.C 43.31,74.69 R55.1
N$29
  Top 0.152: OUT7.C 48.39,74.69 R56.1
N$30
  Bottom 0.152: R28.2 13.78,6.29 J2.11
N$31
  Bottom 0.152: R29.2 6.16,6.84 J2.10
N$32  (via drill 0.35)
  Top 0.152: v8.94,33.02 8.15,33.81 R36.2
  Bottom 0.152: U5.7 8.94,29.89 v8.94,33.02
N$33  (via drill 0.35)
  Top 0.152: v10.21,33.02 10.21,34.23 R35.2
  Bottom 0.152: U5.8 9.46,32.27 v10.21,33.02
N$34
  Top 0.152: T11.3 111.64,52.07 109.27,49.7 LS1.N
N$35
  Top 0.152: T11.1 109.44,57.28 R33.2
N$36
  Top 0.152: OUT8.C 53.47,74.69 R57.1
N$37  (via drill 0.35)
  Top 0.152: v15.29,33.02 R40.2
  Bottom 0.152: U5.11 10.96,31.23 12.14,32.41 13,32.41 13.61,33.02 v15.29,33.02
N$38
  Top 0.152: OUT9.C 58.55,74.69 R58.1
N$39
  Top 0.152: OUT10.C 63.63,74.69 R59.1
N$40
  Top 0.152: IN_10.C 85.36,12.8 R73.1
N$41
  Top 0.152: R64.1 39.64,12.8 IN_1.C
N$42
  Top 0.152: BOOT1.1 80.06,30.23 R61.2
N$43
  Top 0.152: R60.2 89.2,28.01 BOOT0.1
N$44
  Top 0.152: R62.1 86.16,28.01 BOOT0.3
N$45
  Top 0.152: R63.1 82.6,30.23 BOOT1.3
N$46
  Top 0.152: IN_2.C 44.72,12.8 R65.1
N$47
  Top 0.152: IN_3.C 49.8,12.8 R66.1
N$48
  Top 0.152: IN_4.C 54.88,12.8 R67.1
N$49
  Top 0.152: IN_5.C 59.96,12.8 R68.1
N$50
  Top 0.152: IN_6.C 65.04,12.8 R69.1
N$51
  Top 0.152: IN_7.C 70.12,12.8 R70.1
N$52
  Top 0.152: IN_8.C 75.2,12.8 R71.1
N$53
  Top 0.152: IN_9.C 80.28,12.8 R72.1
N$54
  Top 0.152: IN_11.C 90.44,12.8 R74.1
OSC_IN  (via drill 0.35)
  Top 0.152: C26.2 42.17,47.46 41.83,47.12 | 41.83,47.12 Q1.2 | 39.42,46.99 40.69,46.99 | 41.83,46.75 41.83,46.99 | 41.83,46.99 41.83,47.12 | 40.69,46.99 41.83,46.99 | 40.69,46.99 37.86,44.16 R37.2 37.86,37.45 v39.57,35.74 | U3.12 50.49,32.25 50.6,32.36 51.51,32.36 v52.12,31.75
  Bottom 0.152: v52.12,31.75 51.71,31.75 51.1,32.36 42.93,32.36 39.57,35.71 v39.57,35.74
OSC_OUT  (via drill 0.35)
  Top 0.152: C27.2 31.8,51.07 31.8,46.99 Q1.1 33.07,46.99 35.96,44.1 R37.1 | 35.96,43.09 R37.1 | U3.13 v50.85,31.75 | R37.1 37.23,41.5 37.23,37.09 v39.98,34.34
  Bottom 0.152: v50.85,31.75 50.72,31.88 42.47,31.88 40,34.34 v39.98,34.34
POWER_IN
  Top 0.61: X3.2 12.62,80.34 F1.1
R1_S
  Top 0.152: 19.1,67.25 R12.1 22.53,67.33 23.41,66.45 24.7,66.45 25.37,65.78 32.72,65.78 33.07,65.43 42.98,65.43 46.43,61.98 57.81,61.98 58.1,61.69 58.1,47.68 55.93,45.51 U3.88
R2_S
  Top 0.152: U3.87 56.43,45.58 58.41,47.56 58.41,61.81 57.94,62.28 46.56,62.28 43.1,65.73 33.38,65.73 33.02,66.09 25.5,66.09 R13.1
R3_S
  Top 0.152: U3.86 56.93,45.65 58.71,47.43 58.71,61.94 58.06,62.59 46.68,62.59 43.23,66.04 33.98,66.04 32.69,67.33 R14.1
R4_S
  Top 0.152: U3.85 57.43,45.72 59.02,47.31 59.02,62.06 58.19,62.89 46.84,62.89 43.28,66.45 38.65,66.45 37.77,67.33 R15.1
R5_S
  Top 0.152: U3.84 57.93,45.72 59.32,47.11 59.32,62.22 58.34,63.2 46.98,63.2 42.85,67.33 R16.1
R6_S
  Top 0.152: U3.83 58.43,45.72 59.63,46.91 59.63,62.34 58.47,63.5 47.13,63.5 44.58,66.06 R17.1
R7_S
  Top 0.152: U3.80 59.93,43.18 60.71,43.95 60.71,44.95 59.93,45.72 59.93,63.31 58.47,64.77 50.85,64.77 49.66,65.96 R18.1
R8_S
  Top 0.152: U3.79 60.43,43.18 61.16,43.91 61.16,44.99 60.43,45.72 60.43,64.08 58.47,66.04 55.93,66.04 54.74,67.23 R19.1
R9_S
  Top 0.152: R20.1 59.74,67.25 59.74,66.04 60.93,64.85 60.93,45.72 61.62,45.03 61.62,43.89 60.93,43.2 U3.78
R10_S
  Top 0.152: R21.1 63.61,66.04 62.53,66.04 61.32,64.82 61.32,45.82 62,45.14 62,43.84 61.43,43.27 U3.77
RST  (via drill 0.35)
  Top 0.152: U3.14 50.49,31.25 50.6,31.14 52.78,31.14 v53.39,31.75 | R32.1 C25.1 40.69,37.15 40.69,32.73 v40.65,32.69
  Bottom 0.152: v53.39,31.75 52.98,31.75 52.37,31.14 50.6,31.14 50.3,31.45 41.89,31.45 v40.65,32.69
RTC_CHARGE  (via drill 0.35)
  Top 0.152: R34.1 v97.84,21.59 | U3.35 54.43,20.32 53.9,19.79 v53.9,17.88
  Bottom 0.152: v97.84,21.59 94.13,17.88 v53.9,17.88
SPI1_EXCS  (via drill 0.35)
  Top 0.152: U3.95 52.43,40.33 v50.85,41.91
  Bottom 0.152: v50.85,41.91 50.85,43.18 55.93,48.26 64.82,48.26 68.63,52.07 EXT.1
SPI1_MISO  (via drill 0.35)
  Top 0.152: U3.90 54.93,45.99 v55.93,46.99 | U4.2 113.72,28.57 114.35,29.21 v114.35,44.45
  Bottom 0.152: v55.93,46.99 69.77,46.99 70.76,47.98 71.58,47.98 72.57,46.99 EXT.6 111.81,46.99 v114.35,44.45
SPI1_MOSI  (via drill 0.35)
  Top 0.152: U3.91 54.43,43.41 v53.39,44.45 | U4.5 102.29,31.11 100.38,33.02 v100.38,41.91
  Bottom 0.152: v53.39,44.45 57.2,44.45 58.47,43.18 72.44,43.18 EXT.8 97.84,44.45 v100.38,41.91
SPI1_SCK  (via drill 0.35)
  Top 0.152: U3.89 55.43,37.33 v55.93,36.83 | EXT.10 74.37,41.25 v74.37,38.35 74.37,29.82 v74.98,29.21 | U4.6 102.29,29.84 v100.38,27.94
  Bottom 0.152: v55.93,36.83 73.35,36.83 74.37,37.85 v74.37,38.35 | v100.38,27.94 76.25,27.94 v74.98,29.21
SWCLK  (via drill 0.35)
  Top 0.152: U3.76 61.93,43.24 64.16,45.47 64.16,45.97 63.98,46.15 63.98,50.37 v63.55,50.8
  Bottom 0.152: v63.55,50.8 53.39,50.8 52.12,52.07 50.85,53.34 PROG.6
SWDIO  (via drill 0.35)
  Top 0.152: v64.82,53.34 64.82,40.64 62.28,38.1 62.28,36.86 62.76,36.38 63.48,36.38 U3.72
  Bottom 0.152: PROG.2 63.55,54.61 v64.82,53.34
USART1_DE  (via drill 0.35)
  Top 0.152: U3.66 69.29,33.25 70.98,34.94 71.35,34.94 71.96,35.55 72.43,35.55 v72.41,35.57 | v101.55,38.07 v101.55,54.61 101.55,57.37 R8.1 | U2.3 99.75,65.41 v99.11,64.77
  Bottom 0.152: v72.41,35.57 97.48,35.57 98.68,36.78 100.33,36.78 101.55,38 v101.55,38.07 | v99.11,64.77 99.11,57.15 101.65,54.61 v101.55,54.61
USART1_RE  (via drill 0.35)
  Top 0.152: U3.67 68.26,33.75 68.38,33.63 69.24,33.63 71.08,35.47 71.18,35.47 v71.1,35.55 | R9.1 104.29,57.37 v104.29,54.61 v104.29,38.02 | U2.2 99.75,66.67 v99.11,66.04
  Bottom 0.152: 71.69,34.95 71.69,34.96 v71.1,35.55 71.18,35.55 71.79,34.94 97.28,34.94 98.81,36.47 102.74,36.47 v104.29,38.02 | v99.11,66.04 100.38,64.77 100.38,57.15 102.92,54.61 v104.29,54.61
USART1_RX  (via drill 0.35)
  Top 0.152: v68.63,35.14 68.22,35.14 67.61,34.54 67.11,34.54 66.9,34.75 U3.69 | v106.73,37.9 v106.73,55.88 R10.1 106.73,57.65 | 101.43,67.94 U2.1 99.75,67.94 v99.11,67.31
  Bottom 0.152: v68.63,35.14 69.14,34.63 97.4,34.63 98.94,36.17 105,36.17 v106.73,37.9 | v99.11,67.31 101.65,64.77 101.65,58.42 104.19,55.88 v106.73,55.88
USART1_TX  (via drill 0.35)
  Top 0.152: U3.68 66.96,34.25 66.98,34.23 67.74,34.23 v68.63,34.23 | R7.1 98.96,57.32 98.96,55.88 | 98.96,55.88 v98.96,35.23 | 98.96,55.88 97.76,57.07 97.76,63.42 98.48,64.14 U2.4
  Bottom 0.152: 68.69,34.29 v68.63,34.23 97.96,34.23 v98.96,35.23
USB_DM  (via drill 0.35)
  Top 0.152: U3.70 67.05,35.25 67.25,35.45 67.36,35.45 v67.36,35.14 | EXT.2 75.59,50.19 v75.59,38.51
  Bottom 0.152: v67.36,35.14 68.74,36.52 73.5,36.52 75.48,38.51 v75.59,38.51
USB_DP  (via drill 0.35)
  Top 0.152: U3.71 69.89,35.75 70.09,35.95 v70.15,35.89 | v74.98,37.13 74.98,48.26 EXT.4
  Bottom 0.152: v70.15,35.89 70.46,36.2 73.63,36.2 74.57,37.13 v74.98,37.13
VCC  (via drill 0.35)
  Top 0.152: U3.11 45.75,32.75 C19.1 45.2,33.02 v43.23,33.02 41.86,31.65 L2.2 | U3.75 64.88,39.02 66.09,39.02 C23.1 66.41,39.37 67.36,39.37 v68.63,40.64 | U3.28 50.93,21.99 C21.1 | U3.50 61.93,21.94 62.57,21.3 63.35,21.3 64.32,20.32 C22.1 | U4.8 107.03,28.57 C6.1 106.98,33.49 v106.98,35.26 | U6.5 33.07,56.1 C28.1 31.98,56.06 v31.8,55.88 | R32.2 41.96,40.64 v43.23,39.37 | C21.1 50.85,21.27 | C22.1 64.82,20 | IN_1.A 41.74,14.27 v41.91,14.1 | IN_2.A 46.99,15.07 v46.99,14.1 | IN_3.A 51.9,14.14 v51.94,14.1 | IN_4.A 57.16,15.06 v57.16,14.11 v57.15,14.1 | v62.08,14.1 62.06,14.11 IN_5.A | IN_7.A 72.36,15.1 v72.36,14.1 | IN_8.A 77.44,15.1 v77.44,14.1 | IN_9.A 82.6,15.02 v82.6,14.07 | R63.2 82.63,25.7 v82.63,24.54 | IN_10.A 87.5,15.2 v87.5,14.1 | v92.58,14.1 92.54,14.14 IN_11.A | R49.1 90.22,9.84 v90.22,7.62 | R47.1 85.14,9.84 v85.14,7.62 | R48.1 80.06,9.84 v80.06,7.62 | R46.1 74.98,9.84 v74.98,7.62 | R42.1 69.9,9.84 v69.9,7.62 | R45.1 64.82,9.84 v64.82,7.62 | R41.1 59.74,9.84 v59.74,7.62 | R43.1 54.66,9.84 v54.66,7.62 | R31.1 49.58,9.84 v49.58,7.62 | R30.1 44.5,9.84 v44.5,7.62 | R44.1 39.45,9.87 v39.45,7.64 | v87.78,64.97 86.53,64.97 C8.1 82.92,65.09 81.97,64.14 U7.3 | U2.8 108.32,67.94 C7.1 110.86,66.99 v111.81,66.04 111.81,60.96 110.54,59.69 107.05,59.69 R10.2 R9.2 | R7.2 R9.2 | v21.64,36.83 21.4,36.59 R39.2 R38.2 | IC1.2 106.1,15.88 105.14,16.83 C5.1 101.31,16.48 v100.3,16.48 | C22.1 v65.73,20.32 | C21.1 v51.71,21.59 | CRYSTAL1.4 42,59.58 v42.14,59.72 | R26.1 v25.45,31.75 | L1.1 3.4,31.29 v3.86,31.75 | v45.85,41.94 46.24,41.54 C24.1 48.68,41.54 49.93,40.29 U3.100 | IN_6.A 67.16,15.22 v67.16,14.1 | 38.15,70.96 OUT5.A 38.23,69.93 v38.15,69.85
  Top 0.152: OUT1.A 17.91,69.93 v17.83,69.85 | OUT2.A 22.99,69.93 v22.91,69.85 | OUT3.A 28.07,69.93 v27.99,69.85 | OUT4.A 33.15,69.93 v33.07,69.85 | OUT6.A 43.31,69.93 v43.23,69.85 | OUT7.A 48.39,69.93 v48.31,69.85 | OUT8.A 53.47,69.93 v53.39,69.85 | OUT9.A 58.55,69.93 v58.47,69.85 | OUT10.A 63.63,69.93 v63.55,69.85 | R62.2 86.44,25.7 v86.44,24.51 | R1.1 48.31,47.94 | 48.31,47.94 R2.1 | 48.31,47.94 v48.31,48.92 49.9,50.51 C31.2 49.58,50.8 48.31,52.07 PROG.8 | v10.21,31.75 11.48,33.02 12.75,33.02 12.93,33.2 C17.1 | R8.2 R9.2 | U3.21 46.4,27.75 45.99,28.16 | 45.99,28.16 C32.1 | U3.22 45.77,27.25 | 45.77,27.25 42.77,27.25 L2.1 41.76,28.26 C20.1 37.68,28.26 37.08,28.86 v36.88,28.86 | 45.77,27.25 45.77,27.94 45.99,28.16
  Top 0.61: U1.4 U1.2 17.5,57.17 C30.+ C4.1 v25.45,56.83 v26.72,56.83 27.67,56.83 v27.99,57.15 v29.26,58.42
  Bottom 0.152: C18.1 68.95,49.53 EXT.3 | U5.9 9.96,31.5 v10.21,31.75
  pour VCC: 5.13,81.28 2.59,78.74 2.59,5.08 5.13,2.54 110.54,2.54 113.08,5.08 113.08,77.47 109.27,81.28
VREF-  (via drill 0.35)
  Top 0.152: U3.20 50.54,28.25 v50.85,27.94
W25Q64_CS  (via drill 0.35)
  Top 0.152: U4.1 109.91,27.3 108.94,26.34 v108.28,26.34 | U3.54 69.32,27.25 v69.9,26.67
  Bottom 0.152: v108.28,26.34 108.25,26.32 71.5,26.32 71.24,26.06 70.51,26.06 v69.9,26.67
W25Q64_HOLD  (via drill 0.35)
  Top 0.152: v101.65,27.94 102.29,28.57 U4.7 | v70.81,27.71 70.28,28.25 U3.56
  Bottom 0.152: v101.65,27.94 100.69,26.98 71.55,26.98 v70.81,27.71
W25Q64_WP  (via drill 0.35)
  Top 0.152: U4.3 109.91,29.84 v108,27.94 | U3.55 69.91,27.75 v70.99,26.67
  Bottom 0.152: v70.99,26.67 105.46,26.67 106.73,26.67 v108,27.94
X1
  Top 0.305: X1.1 20.05,79.33 R50.2 20.45,74.53 T1.3
X2
  Top 0.305: X1.2 25.13,79.33 R51.2 25.53,74.53 T2.3
X3
  Top 0.305: 30.53,79.65 X1.3 30.21,79.33 R52.2 30.61,74.53 T3.3
X4
  Top 0.305: X1.4 35.45,79.49 35.45,75.09 R53.2 35.69,74.53 T4.3
X5
  Top 0.305: X1.5 40.37,79.33 R54.2 40.77,74.53 T5.3
X6
  Top 0.305: X1.6 45.45,79.33 R55.2 45.85,74.53 T6.3
X7
  Top 0.305: X1.7 50.53,79.33 R56.2 50.93,74.53 T7.3
X8
  Top 0.305: X1.8 55.61,79.33 R57.2 56.01,74.53 T8.3
X9
  Top 0.305: X1.9 60.69,79.33 R58.2 61.09,74.53 T9.3
X10
  Top 0.305: X1.10 65.77,79.33 R59.2 66.17,74.53 T10.3
X50_OUT
  Top 0.152: U6.2 38.49,59.69 CRYSTAL1.3

## Text on the board
tNames: CAN | VIN | GND | RS485 | A B GND | GND CANL CANH